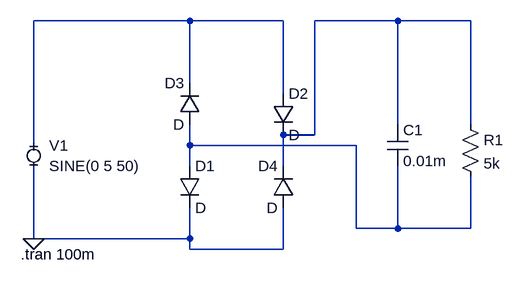
[diagram p0: schematic Draft2.asc]
Draft2.asc, the LTspice schematic file:
Version 4
SHEET 1 880 680
WIRE 144 -64 -96 -64
WIRE 288 -64 144 -64
WIRE 464 -64 336 -64
WIRE 576 -64 464 -64
WIRE 144 32 144 -64
WIRE 288 48 288 -64
WIRE 464 96 464 -64
WIRE 576 96 576 -64
WIRE 336 112 336 -64
WIRE 336 112 288 112
WIRE -96 128 -96 -64
WIRE 144 128 144 96
WIRE 400 128 144 128
WIRE 144 160 144 128
WIRE 288 160 288 112
WIRE 400 256 400 128
WIRE 464 256 464 160
WIRE 464 256 400 256
WIRE 576 256 576 176
WIRE 576 256 464 256
WIRE -96 272 -96 160
WIRE 144 272 144 224
WIRE 144 272 -96 272
WIRE 144 288 144 272
WIRE 288 288 288 224
WIRE 288 288 144 288
FLAG -96 272 0
SYMBOL diode 128 160 R0
SYMATTR InstName D1
SYMBOL diode 160 96 R180
WINDOW 0 24 64 Left 2
WINDOW 3 24 0 Left 2
SYMATTR InstName D3
SYMBOL MiniSyms4\\voltage- -96 144 R0
WINDOW 123 0 0 Left 2
WINDOW 39 0 0 Left 2
SYMATTR InstName V1
SYMATTR Value SINE(0 5 50)
SYMBOL cap 448 96 R0
SYMATTR InstName C1
SYMATTR Value 0.01m
SYMBOL res 560 80 R0
SYMATTR InstName R1
SYMATTR Value 5k
SYMBOL diode 272 48 R0
SYMATTR InstName D2
SYMBOL diode 304 224 R180
WINDOW 0 24 64 Left 2
WINDOW 3 24 0 Left 2
SYMATTR InstName D4
TEXT -116 296 Left 2 !.tran 100m

The netlist it stands for:
* Draft2.asc
D1 N003 0 D
D3 N003 N001 D
V1 N001 0 SINE(0 5 50)
C1 N002 N003 0.01m
R1 N002 N003 5k
D2 N001 N002 D
D4 0 N002 D
.model D D
.lib standard.dio
.tran 100m
.backanno
.end